# Altium schematic sheet Sheet2.SchDoc: PANO-SETI  Shutter, Stepper Driver
size B; Organization: Lafleur Designs; Address1: Tom Lafleur; Address2: tom@lafleur.us; Revision: 3c; SheetNumber: 2
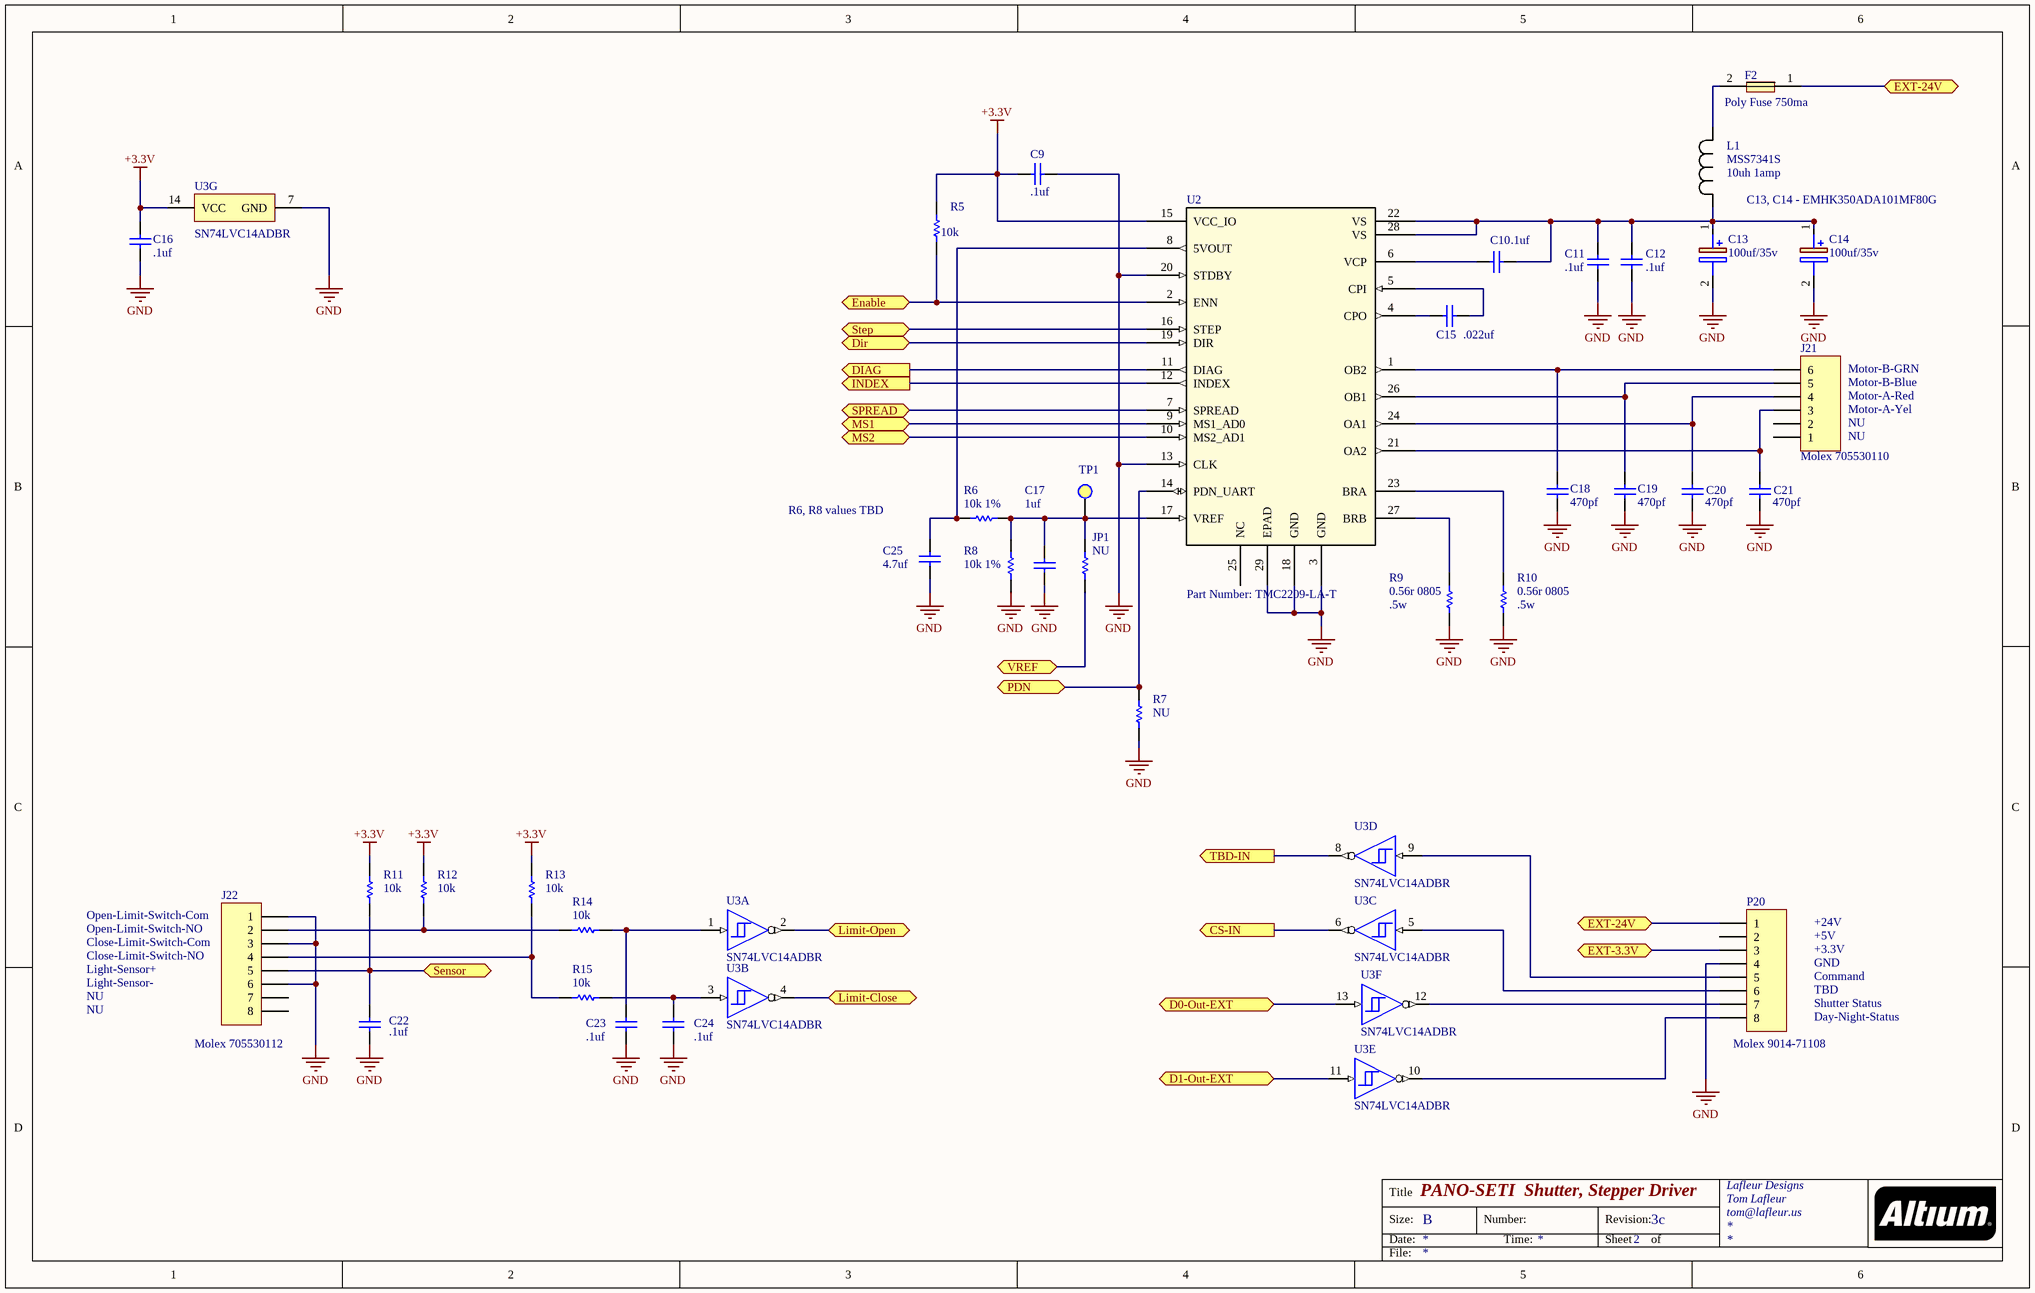
[diagram p0: Sheet2.SchDoc]

## Parts
C9  .1uf  [6-0805]
C10  .1uf  [6-0805]
C11  .1uf  [6-0805]
C12  .1uf  [6-0805]
C13  100uf/35v  [CAPAE660X610N]
C14  100uf/35v  [CAPAE660X610N]
C15  .022uf  [6-0805]
C16  .1uf  [6-0805]
C17  1uf  [6-0805]
C18  470pf  [6-0805]
C19  470pf  [6-0805]
C20  470pf  [6-0805]
C21  470pf  [6-0805]
C22  .1uf  [6-0805]
C23  .1uf  [6-0805]
C24  .1uf  [6-0805]
C25  4.7uf  [6-0805]
F2  Poly Fuse 750ma  [PTC 2016L]
J21  Molex 705530110  [HDR1X6]
J22  Molex 705530112  [HDR1X8]
JP1  NU  [6-0805]
L1  MSS7341S  [MSS7341502NLD]
P20  Molex 9014-71108  [HDR1X8]
R5  10k  [6-0805]
R6  10k 1%  [6-0805]
R7  NU  [6-0805]
R8  10k 1%  [6-0805]
R9  0.56r 0805  [6-0805]
R10  0.56r 0805  [6-0805]
R11  10k  [6-0805]
R12  10k  [6-0805]
R13  10k  [6-0805]
R14  10k  [6-0805]
R15  10k  [6-0805]
TP1  TestPoint  [Test Point-Thru-Hole]  (value not drawn)
U2  Part Number: TMC2209-LA-T  [QFN50P500X500X90-29N]
U3  SN74LVC14ADBR  [DB0014A_M]  (parts A,B,C,D,E,F,G of 7)

## Ports
CS-IN (out), D0-Out-EXT (bidir), D1-Out-EXT (bidir), DIAG (out), Dir (bidir), Enable (bidir), EXT-3.3V (bidir), EXT-24V (bidir), INDEX (out), Limit-Close (bidir), Limit-Open (bidir), MS1 (bidir), MS2 (bidir), PDN (bidir), Sensor (bidir), SPREAD (bidir), Step (bidir), TBD-IN (out), VREF (bidir)

## Nets
+3.3V: C9.1 C16.2 R5.1 R11.1 R12.1 R13.1 U2.15(VCC_IO) U3.14(VCC)
GND: C9.2 C11.2 C12.2 C13.2(-) C14.2(-) C16.1 C17.2 C18.2 C19.2 C20.2 C21.2 C22.1 C23.1 C24.1 C25.2 J22.1 J22.3 J22.6 P20.4 R7.2 R8.2 R9.2 R10.2 U2.3(GND) U2.13(CLK) U2.18(GND) U2.20(STDBY) U2.29(EPAD) U3.7(GND)
CS-IN: U3.6(~{3Y}) ; port CS-IN
D0-Out-EXT: U3.13(6A) ; port D0-Out-EXT
D1-Out-EXT: U3.11(5A) ; port D1-Out-EXT
DIAG: U2.11(DIAG) ; port DIAG
Dir: U2.19(DIR) ; port Dir
Enable: R5.2 U2.2(ENN) ; port Enable
EXT-3.3V: P20.3 ; port EXT-3.3V
EXT-24V: F2.1 P20.1 ; port EXT-24V
INDEX: U2.12(INDEX) ; port INDEX
Limit-Close: U3.4(~{2Y}) ; port Limit-Close
Limit-Open: U3.2(~{1Y}) ; port Limit-Open
MS1: U2.9(MS1_AD0) ; port MS1
MS2: U2.10(MS2_AD1) ; port MS2
PDN: R7.1 U2.14(PDN_UART) ; port PDN
Sensor: C22.2 J22.5 R11.2 ; port Sensor
SPREAD: U2.7(SPREAD) ; port SPREAD
Step: U2.16(STEP) ; port Step
TBD-IN: U3.8(~{4Y}) ; port TBD-IN
VREF: JP1.2 ; port VREF
NetC10_1: C10.1 U2.6(VCP)
NetC10_2: C10.2 C11.1 C12.1 C13.1(+) C14.1(+) L1.2 U2.22(VS) U2.28(VS)
NetC15_1: C15.1 U2.4(CPO)
NetC15_2: C15.2 U2.5(CPI)
NetC17_1: C17.1 JP1.1 R6.2 R8.1 TP1.1(TP?) U2.17(VREF)
NetC18_1: C18.1 J21.6 U2.1(OB2)
NetC19_1: C19.1 J21.5 U2.26(OB1)
NetC20_1: C20.1 J21.4 U2.24(OA1)
NetC21_1: C21.1 J21.3 U2.21(OA2)
NetC23_2: C23.2 R14.2 U3.1(1A)
NetC24_2: C24.2 R15.2 U3.3(2A)
NetC25_1: C25.1 R6.1 U2.8(5VOUT)
NetF2_2: F2.2 L1.1
NetJ22_2: J22.2 R12.2 R14.1
NetJ22_4: J22.4 R13.2 R15.1
NetP20_5: P20.5 U3.9(4A)
NetP20_6: P20.6 U3.5(3A)
NetP20_7: P20.7 U3.12(~{6Y})
NetP20_8: P20.8 U3.10(~{5Y})
NetR9_1: R9.1 U2.27(BRB)
NetR10_1: R10.1 U2.23(BRA)

Not connected (* = marked no-connect by the designer): J21 1 2; J22 7 8; P20 2; U2 25(NC)

## Notes on the sheet
- (near L1) 10uh 1amp
- C13, C14 - EMHK350ADA101MF80G
- (near J21) Motor-B-GRN
- (near J21) NU
- (near J21) Motor-A-Red
- (near J21) Motor-A-Yel
- (near J21) Motor-B-Blue
- R6, R8 values TBD
- .5w
- (near R10) .5w
- Light-Sensor+
- (near J22) Open-Limit-Switch-Com
- Open-Limit-Switch-NO
- (near J22) Close-Limit-Switch-Com
- (near J22) Close-Limit-Switch-NO
- +24V
- +5V
- +3.3V
- GND
- NU
- Light-Sensor-
- Shutter Status
- TBD
- Day-Night-Status
- Command
- Title
- Size:
- Date:
- B
- Number:
- Time:
- Revision:
- Sheet
- of
- File:

## Library data of the parts
C9-C12 C15-C25 = CAP_2: Capacitor; Fitted: True
C13 C14 = EEE-FT1V101AP: Capacitor Polarised; Manufacturer_Name: Panasonic; Allied_Number: 70258385; Datasheet Link: https://industrial.panasonic.com/cdbs/www-data/pdf/RDE0000/ABA0000C1240.pdf; Height: 6.1mm; Manufacturer_Part_Number: EEE-FT1V101AP; Mouser Part Number: 667-EEE-FT1V101AP; Mouser Price/Stock: https://www.mouser.com/Search/Refine.aspx?Keyword=667-EEE-FT1V101AP; Allied Price/Stock: https://www.alliedelec.com/panasonic-eee-ft1v101ap/70258385/
F2 = Poly Fuse
J21 = Header 6: Header, 6-Pin; LatestRevisionDate: 17-Jul-2002; LatestRevisionNote: Re-released for DXP Platform.; Publisher: Altium Limited
J22 P20 = Header 8: Header, 8-Pin; LatestRevisionDate: 17-Jul-2002; LatestRevisionNote: Re-released for DXP Platform.; Publisher: Altium Limited
JP1 R5-R15 = ERJ8EN: Precision Thick Film Chip Resistor, 10 Ohm to 2.2M Ohm Range, 1% Tolerance, 1206 Size, 0.125 W; Published: 17-Dec-2003; LatestRevisionDate: 19-Mar-2004; LatestRevisionNote: Silkscreen size reduced.; PackageDocument: Mar-2003; PackageReference: 8-1206; Publisher: Altium Limited; Code_IPC: 3216 [1206]; ComponentLink1Description: Manufacturer Link; ComponentLink1URL: http://www.panasonic.com/industrial/components/resistive_products.htm; ComponentLink2Description: Datasheet; ComponentLink2URL: http://www.panasonic.com/industrial/components/pdf/AOA0000CE2.pdf
L1 = SRU1048-101Y: No Description Available; Vendor: Bourns Electronics; Built_By: EMA_UL_Team; Manufacturer_Part_Number: SRU1048-101Y; Copyright: Copyright (C) 2018 Accelerated Designs. All rights reserved; Value: Value
U2 = TMC2209-LA-T: No Description Available; Vendor: Trinamic; Manufacturer_Part_Number: TMC2209-LA-T; Copyright: Copyright (C) 2018 Accelerated Designs. All rights reserved; RefDes: RefDes; Type: DEV; Value: Value
U3 = CMP-1615-00327-3: Hex Schmitt-Trigger Inverter, DB0014A, LARGE T&R; Manufacturer: Texas Instruments; tpd @ Nom Voltage(Max)(ns): 11,7.8,7.5,6.4; Output Type: CMOS; Voltage(Nom)(V): 1.8,2.5,2.7,3.3; F @ Nom Voltage(Max)(Mhz): 100; ICC @ Nom Voltage(Max)(mA): 0.01; Input Type: CMOS,TTL; VCC(Max)(V): 3.6; Schmitt Trigger: Yes; Technology Family: LVC; VCC(Min)(V): 2; Output Drive (IOL/IOH)(Max)(mA): -24/24; Bits(#): 6; Rating: Catalog; Code_JEDEC: MO-150; PackageReference: DB0014A; Generic Part Number: SN74LVC14A; Operating Temperature Range(C): -40 to 125; DatasheetVersion: SCAS285AA